# EAGLE schematic Connections (EAGLE 9.6.2)
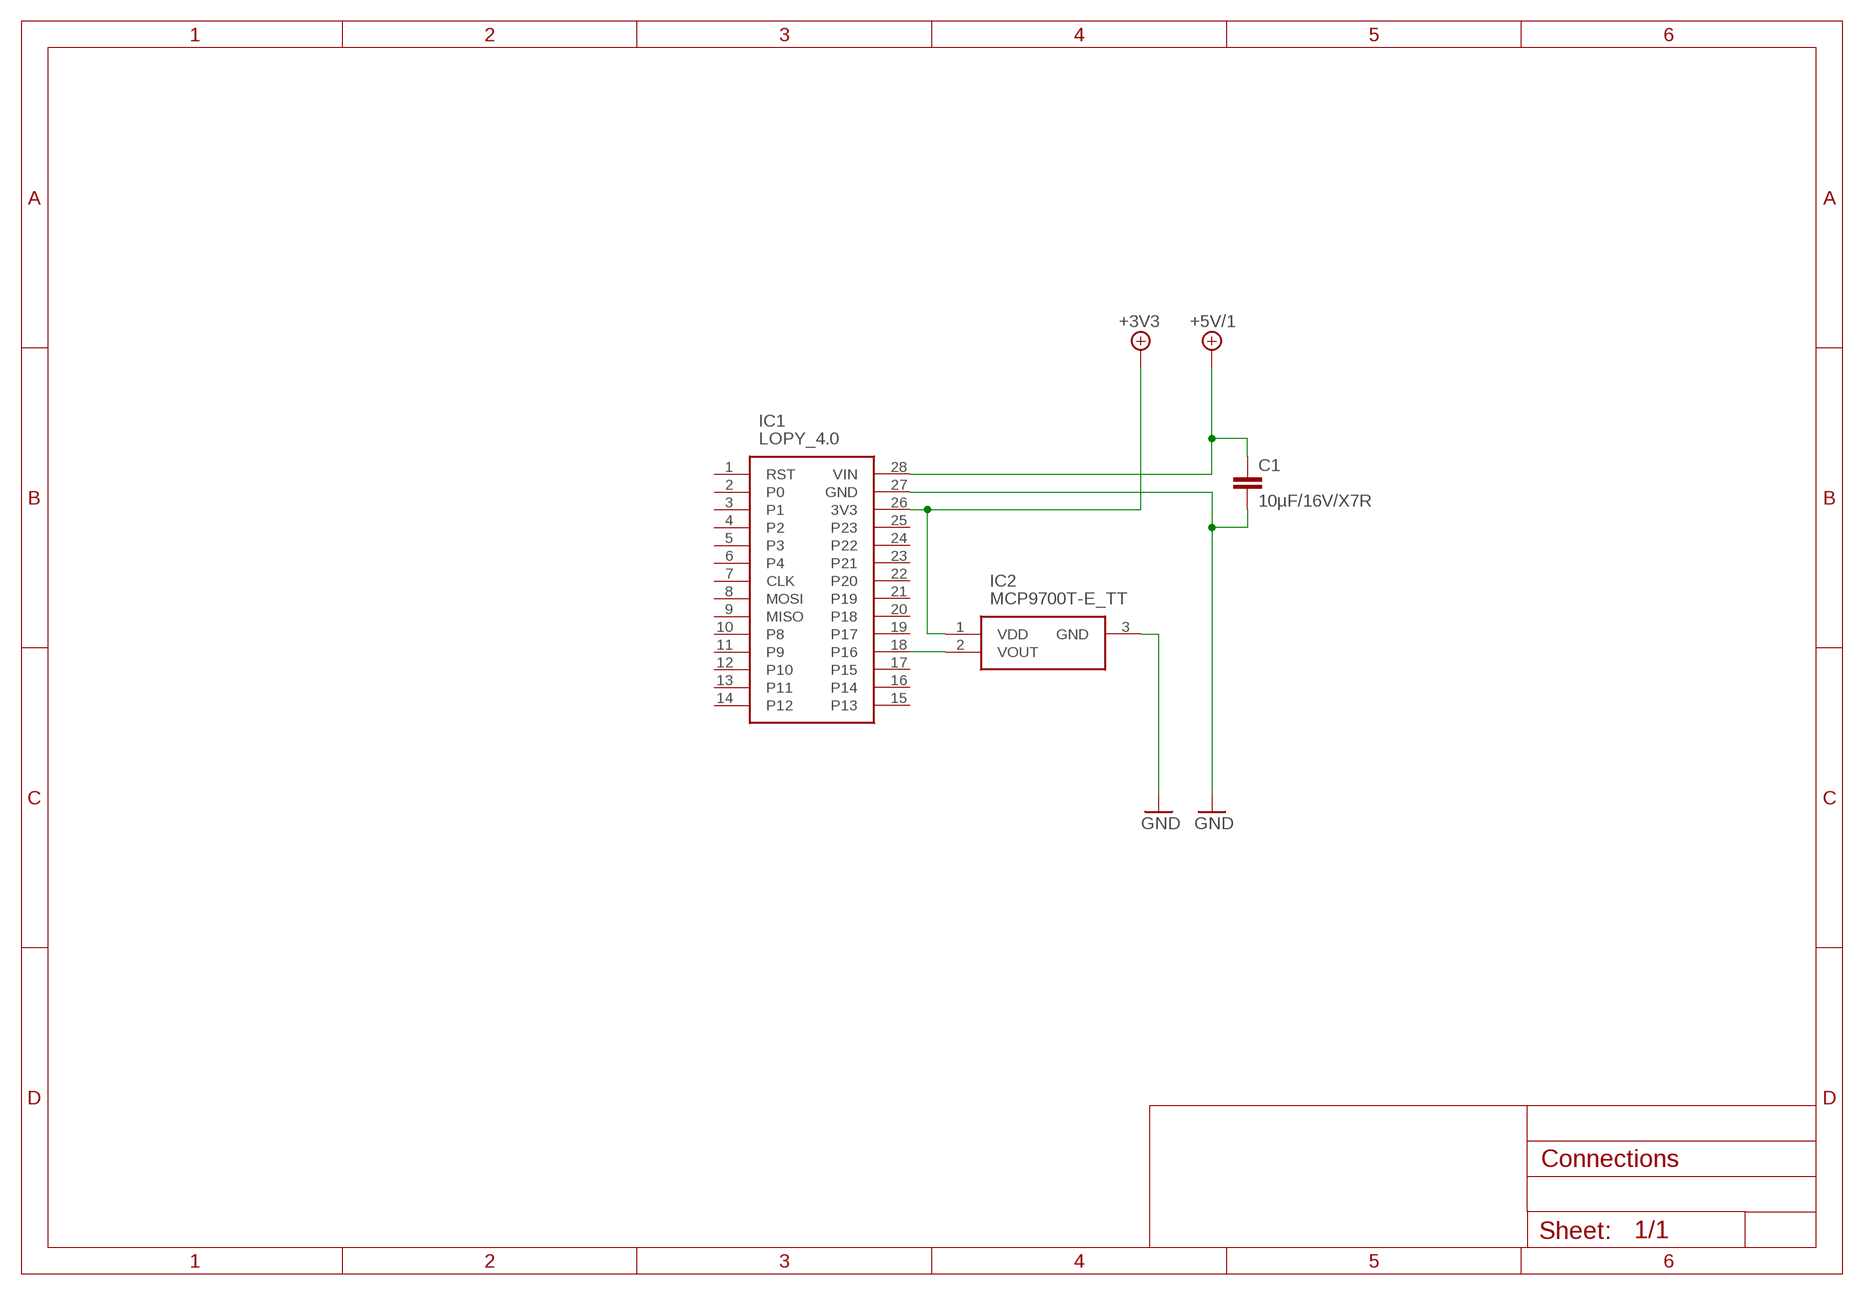
[diagram p0: schematic, sheet 1]

## Parts
C1  10µF/16V/X7R  C-EUC0603  [C0603]
IC1  LOPY_4.0  [LOPY40]
IC2  MCP9700T-E_TT  [SOT95P237X112-3N]

## Nets
+3V3: IC1.26(3V3) IC2.1(VDD)
+5V/1: C1.1 IC1.28(VIN)
GND: C1.2 IC1.27(GND) IC2.3(GND)
N$1: IC1.18(P16) IC2.2(VOUT)
Unconnected: IC1.1(RST) IC1.2(P0) IC1.3(P1) IC1.4(P2) IC1.5(P3) IC1.6(P4) IC1.7(CLK) IC1.8(MOSI) IC1.9(MISO) IC1.10(P8) IC1.11(P9) IC1.12(P10) IC1.13(P11) IC1.14(P12) IC1.15(P13) IC1.16(P14) IC1.17(P15) IC1.19(P17) IC1.20(P18) IC1.21(P19) IC1.22(P20) IC1.23(P21) IC1.24(P22) IC1.25(P23)

## Library data of the parts
C1 = rcl:C-EU: CAPACITOR, European symbol; SPICEPREFIX: C
IC1 = SamacSys_Parts:LOPY_4.0: WiFi Development Tools (802.11) Sigfox, LoRa, 433MHZ BLE & WIFI Dev board Source: Datasheet <https://docs.pycom.io/datasheets/development/lopy4/>; ARROW_PART_NUMBER: LoPy 4.0; DESCRIPTION: WiFi Development Tools (802.11) Sigfox, LoRa, 433MHZ BLE & WIFI Dev board; HEIGHT: 5.8mm; MANUFACTURER_NAME: Pycom; MANUFACTURER_PART_NUMBER: LoPy 4.0; MOUSER_PART_NUMBER: 365-LOPY4; MOUSER_PRICE-STOCK: https://www.mouser.co.uk/ProductDetail/Pycom/LoPy-40?qs=MLItCLRbWsz2Ys%252BwjFa7JA%3D%3D
IC2 = SamacSys_Parts:MCP9700T-E_TT: Linear Active Thermistor 10mV/C SOT23 Source: Datasheet <http://ww1.microchip.com/downloads/en/DeviceDoc/20001942F.pdf>; ARROW_PART_NUMBER: MCP9700T-E/TT; ARROW_PRICE-STOCK: https://www.arrow.com/en/products/mcp9700t-ett/microchip-technology; DESCRIPTION: Linear Active Thermistor 10mV/C SOT23; HEIGHT: 1.12mm; MANUFACTURER_NAME: Microchip; MANUFACTURER_PART_NUMBER: MCP9700T-E/TT; MOUSER_PART_NUMBER: 579-MCP9700T-E/TT; MOUSER_PRICE-STOCK: https://www.mouser.co.uk/ProductDetail/Microchip-Technology/MCP9700T-E-TT?qs=QVBMgXxBiLyzQ04uBGj3mg%3D%3D